# Altium schematic sheet 03-LED-GREEN.SchDoc: Green LEDs
size A; Revision: A; SheetNumber: 3; SheetTotal: 10; ECE315_Project_Name: ECE315 F23 Wack-A-Mole
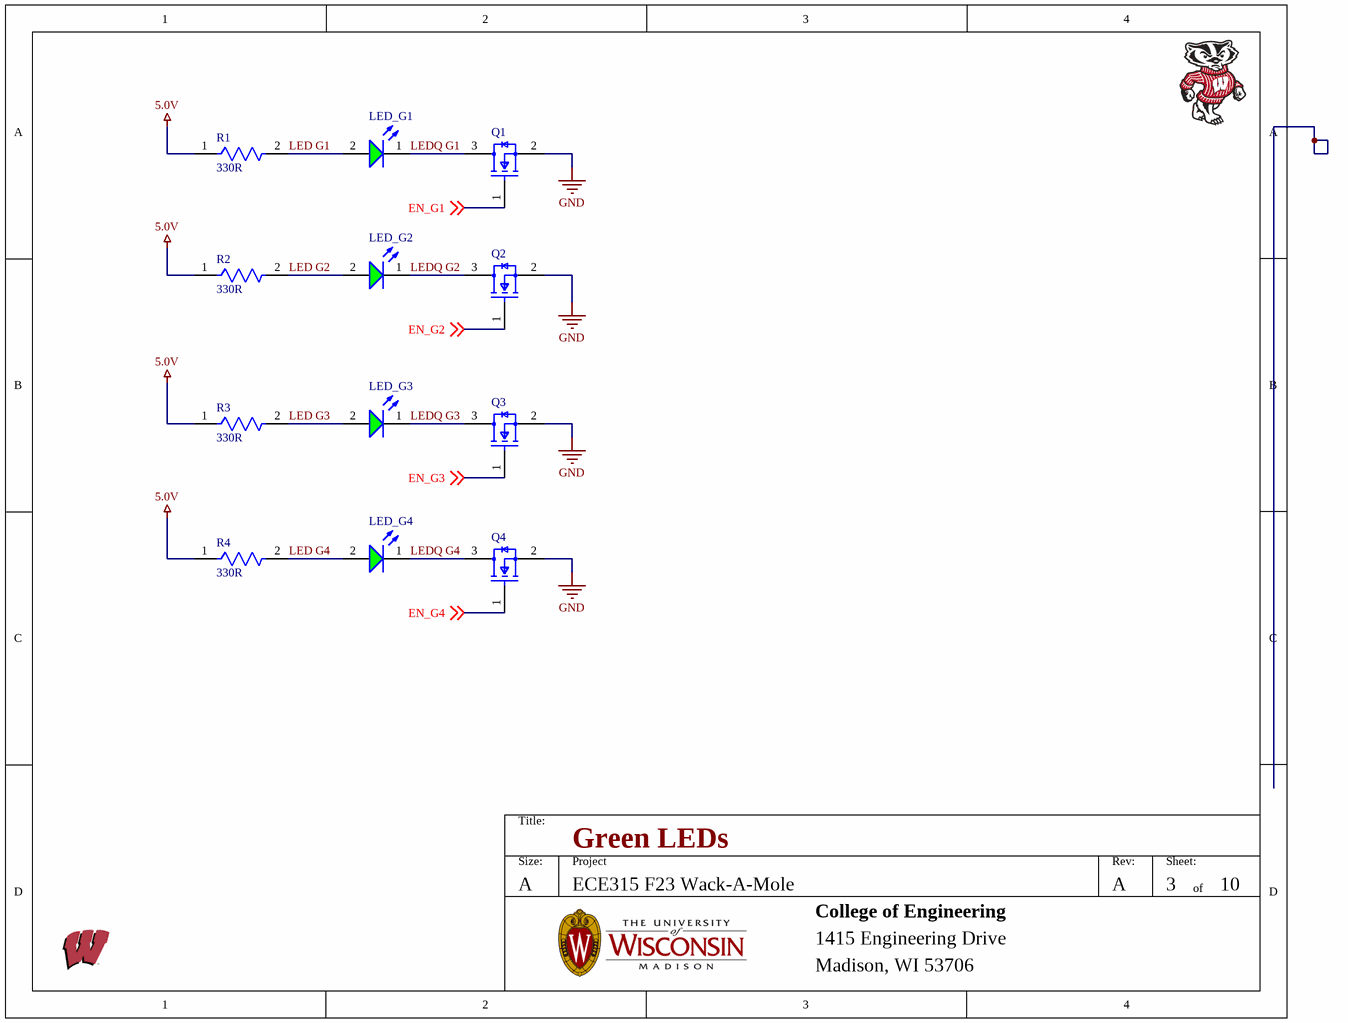
[diagram p0: 03-LED-GREEN.SchDoc]

## Parts
LED_G1  150120GS75000  [WL-SMCW_1206_150120xx75000]  (value not drawn)
LED_G2  150120GS75000  [WL-SMCW_1206_150120xx75000]  (value not drawn)
LED_G3  150120GS75000  [WL-SMCW_1206_150120xx75000]  (value not drawn)
LED_G4  150120GS75000  [WL-SMCW_1206_150120xx75000]  (value not drawn)
Q1  2N7002-7-F  [FP-SOT23-MFG]  (value not drawn)
Q2  2N7002-7-F  [FP-SOT23-MFG]  (value not drawn)
Q3  2N7002-7-F  [FP-SOT23-MFG]  (value not drawn)
Q4  2N7002-7-F  [FP-SOT23-MFG]  (value not drawn)
R1  Resistance: 330R  [FP-CRCW1206-e3-IPC_A]  (hidden comment: CRCW1206330RFKEA)
R2  Resistance: 330R  [FP-CRCW1206-e3-IPC_A]  (hidden comment: CRCW1206330RFKEA)
R3  Resistance: 330R  [FP-CRCW1206-e3-IPC_A]  (hidden comment: CRCW1206330RFKEA)
R4  Resistance: 330R  [FP-CRCW1206-e3-IPC_A]  (hidden comment: CRCW1206330RFKEA)

## Nets
5.0V: R1.1 R2.1 R3.1 R4.1
GND: Q1.2(S) Q2.2(S) Q3.2(S) Q4.2(S)
EN_G1: Q1.1(G) ; off-sheet EN_G1
EN_G2: Q2.1(G) ; off-sheet EN_G2
EN_G3: Q3.1(G) ; off-sheet EN_G3
EN_G4: Q4.1(G) ; off-sheet EN_G4
LED G1: LED_G1.2(A) R1.2
LED G2: LED_G2.2(A) R2.2
LED G3: LED_G3.2(A) R3.2
LED G4: LED_G4.2(A) R4.2
LEDQ G1: LED_G1.1(K) Q1.3(D)
LEDQ G2: LED_G2.1(K) Q2.3(D)
LEDQ G3: LED_G3.1(K) Q3.3(D)
LEDQ G4: LED_G4.1(K) Q4.3(D)

## Notes on the sheet
- Title:
- Size:
- A
- Project
- Rev:
- Sheet:
- of
- College of Engineering
- 1415 Engineering Drive
- Madison, WI 53706

## Library data of the parts
LED_G1-LED_G4 = CMP-1426-00014-3: NexarPartId: 29717787; Manufacturer: Wurth Electronics; Peak Wavelength: 515nm; Wavelength: 520nm; Test Current: 20mA; Dominant Wavelength: 525nm; Luminous Intensity: 450mcd; Max Junction Temperature (Tj): 95°C; Power Dissipation: 105mW; Reverse Voltage: 5V; Forward Current: 100mA; Viewing Angle: 140°; Forward Voltage: 3.2V; Lens Style: Clear, Rectangular; Lens Color: Colorless; Lens Transparency: Clear; Lens Size: 1.6mm; Width: 1.6mm; Case Code (Metric): 3216; Mount: Surface Mount; Min Operating Temperature: -40°C; Packaging: Tape and Reel; Length: 3.2mm; REACH SVHC: Unknown; Max Reverse Voltage (DC): 5V; Case/Package: 1206; Height: 680µm; Case Code (Imperial): 1206; Color: Green; RoHS: Compliant; Max Operating Temperature: 85°C; Supplier: Digi-Key; Supplier Part Number: 732-4990-1-ND; Manufacturer Part Number: 150120GS75000; Category: LEDs; Stock: 46051; Pricing: 1=0.23, 50=0.211, 100=0.182, 500=0.158 (USD); Mounting Technology: Surface Mount; Package Quantity: 1; Series: WL-SMCW; RoHS Compliant: Yes; Reach SVHC Compliant: Unknown; ComponentLink1URL: https://datasheet.ciiva.com/22656/150120gs75000-22656979.pdf?src-supplier=Element14; ComponentLink1Description: https://datasheet.ciiva.com/22656/150120gs75000-22656979.pdf?src-supplier=Element14; ComponentLink2URL: https://datasheet.ciiva.com/29279/759441-da-01-en-chipled-1206-w-kl-gruen-150120gs75000-29279042.pdf?src-supplier=Conrad; ComponentLink2Description: https://datasheet.ciiva.com/29279/759441-da-01-en-chipled-1206-w-kl-gruen-150120gs75000-29279042.pdf?src-supplier=Conrad; ComponentLink3URL: https://datasheet.ciiva.com/29561/150120gs75000-29561883.pdf?src-supplier=Digi-Key; ComponentLink3Description: https://datasheet.ciiva.com/29561/150120gs75000-29561883.pdf?src-supplier=Digi-Key; ComponentLink4URL: https://datasheet.ciiva.com/29561/150120gs75000-29561884.pdf?src-supplier=Digi-Key; ComponentLink4Description: https://datasheet.ciiva.com/29561/150120gs75000-29561884.pdf?src-supplier=Digi-Key; ComponentLink5URL: https://datasheet.ciiva.com/29561/150120gs75000-29561885.pdf?src-supplier=Digi-Key; ComponentLink5Description: https://datasheet.ciiva.com/29561/150120gs75000-29561885.pdf?src-supplier=Digi-Key; ComponentLink6URL: https://datasheet.ciiva.com/48430/150120gs75000-eng-tds-48430053.pdf?src-supplier=Distrelec; ComponentLink6Description: https://datasheet.ciiva.com/48430/150120gs75000-eng-tds-48430053.pdf?src-supplier=Distrelec
Q1-Q4 = CMP-2000-04929-2: MOSFET N-CH 60V 115MA SOT23-3; Turn-On Delay Time: 7ns; Turn-Off Delay Time: 11ns; Drain to Source Resistance: 7.5R; Rise Time: 3ns; Drain to Source Breakdown Voltage: 70V; Input Capacitance: 50pF; Number of Elements: 1; Power Dissipation: 540mW; Max Power Dissipation: 300mW; Fall Time: 5.6ns; Gate to Source Voltage (Vgs): 20V; Threshold Voltage: 2.5V; Element Configuration: Single; Termination: SMD/SMT; Weight: 0.000282oz; Radiation Hardening: No; Max Operating Temperature: 150°C; On-State Resistance: 7.5R; Mount: Surface Mount; Current Rating: 115mA; Contact Plating: Tin; Lead Free: Lead Free; Min Operating Temperature: -55°C; Number of Pins: 3; REACH SVHC: No SVHC; Drain to Source Voltage (Vdss): 60V; Width: 1.3mm; Package Quantity: 3000; Length: 2.9mm; Case/Package: SOT-23; Number of Channels: 1; Dual Supply Voltage: 60V; Packaging: Tape and Reel; Height: 1mm; Voltage Rating (DC): 60V; Nominal Vgs: 2.5V; Continuous Drain Current (ID): 115mA; Voltage: 60V; Rds On Max: 7.5R
R1-R4 = CMP-2003-02098-2: RES Thick Film, 330Ω, 1%, 0.25W, 100ppm/°C, 1206; Voltage Rating: 200V; Max Power Dissipation: 250mW; Height: 0.55mm; Mount: Surface Mount; Min Operating Temperature: -55°C; Depth: 1.6mm; Features: Automotive AEC-Q200; Voltage Rating (DC): 200V; Military Standard: Not; Packaging: Tape and Reel; Composition: Thick Film; Contact Plating: Tin; Case Code (Imperial): 1206; Case/Package: 1206; Number of Terminations: 2; Length: 3.2mm; Lead Free: Lead Free; Tolerance: 1%; Temperature Coefficient: 100ppm/°C; Case Code (Metric): 3216; Width: 1.6mm; Weight: 0.000353oz; Termination: SMD/SMT; Radiation Hardening: No; Package Quantity: 10; Power Rating: 250mW; Max Operating Temperature: 155°C